# EAGLE design bare_attiny85 (EAGLE 8.1.0)
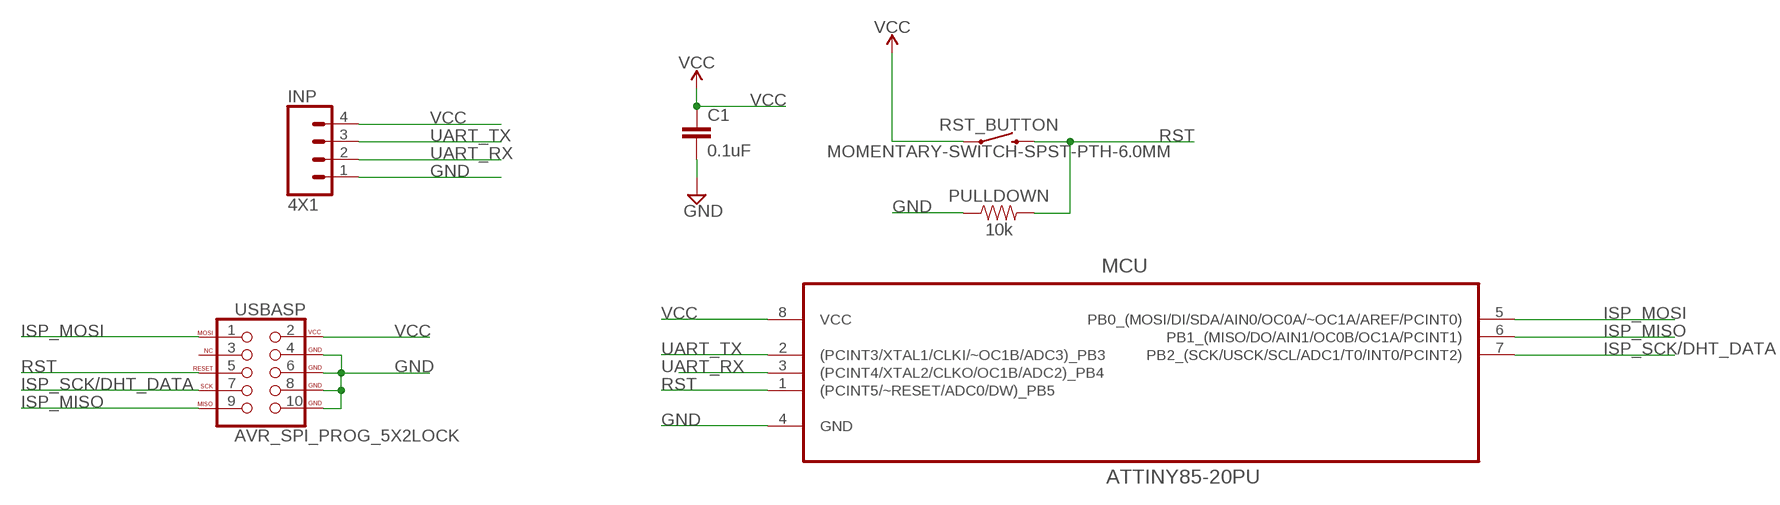
[diagram p0: schematic, sheet 1]

## Parts
C1  0.1uF  0.1UF-KIT-EZ-50V-20%  [CAP-PTH-SMALL-KIT]
INP  4X1  CONN_04  [1X04]
MCU  ATTINY85-20PU  [DIP254P762X533-8]
PULLDOWN  10k  10KOHM-HORIZ-1/4W-1%  [AXIAL-0.3]
RST_BUTTON  MOMENTARY-SWITCH-SPST-PTH-6.0MM  [TACTILE_SWITCH_PTH_6.0MM]
USBASP  AVR_SPI_PROG_5X2LOCK  [2X5-SHROUDED_LOCK]

## Nets
GND: C1.2 INP.1 MCU.4(GND) PULLDOWN.P$1 USBASP.4(GND) USBASP.6(GND) USBASP.8(GND) USBASP.10(GND)
ISP_MISO: MCU.6(PB1_(MISO/DO/AIN1/OC0B/OC1A/PCINT1)) USBASP.9(MISO)
ISP_MOSI: MCU.5(PB0_(MOSI/DI/SDA/AIN0/OC0A/~OC1A/AREF/PCINT0)) USBASP.1(MOSI)
ISP_SCK/DHT_DATA: MCU.7(PB2_(SCK/USCK/SCL/ADC1/T0/INT0/PCINT2)) USBASP.7(SCK)
RST: MCU.1((PCINT5/~RESET/ADC0/DW)_PB5) PULLDOWN.P$2 RST_BUTTON.3 USBASP.5(RESET)
UART_RX: INP.2 MCU.3((PCINT4/XTAL2/CLKO/OC1B/ADC2)_PB4)
UART_TX: INP.3 MCU.2((PCINT3/XTAL1/CLKI/~OC1B/ADC3)_PB3)
VCC: C1.1 INP.4 MCU.8(VCC) RST_BUTTON.1 USBASP.2(VCC)
Unconnected: USBASP.3(NC)

## Library data of the parts
C1 = SparkFun-Capacitors:0.1UF: 0.1µF ceramic capacitors A capacitor is a passive two-terminal electrical component used to store electrical energy temporarily in an electric field.; PROD_ID: CAP-08370
INP = SparkFun-Connectors:CONN_04: Multi connection point. Often used as Generic Header-pin footprint for 0.1 inch spaced/style header connections On any of the 0.1 inch spaced packages, you can populate with these: Break Away Headers - Straight <https://www.sparkfun.com/products/116> (PRT-00116) Break Away Male Headers - Right Angle <https://www.sparkfun.com/products/553> (PRT-00553) Female Headers <https://www.sparkfun.com/products/115> (PRT-00115) Break Away Headers - Machine Pin <https://www.sparkfun.com/products/117> (PRT-00117) Break Away Female Headers - Swiss Machine Pin <https://www.sparkfun.com/products/743> (PRT-00743) For SCREWTERMINALS and SPRING TERMINALS visit here: Screw Terimnals on SparkFun.com <https://www.sparkfun.com/search/results?term=Screw+Terminals> (5mm/3.5mm/2.54mm spacing) This device is also useful as a general connection point to wire up your design to another part of your project. Our various solder wires solder well into these plated through hole pads. Hook-Up Wire - Assortment (Stranded, 22 AWG) <https://www.sparkfun.com/products/11375> (PRT-11375) Hook-Up Wire - Assortment (Solid Core, 22 AWG) <https://www.sparkfun.com/products/11367> (PRT-11367) View the entire wire category on our website here <https://www.sparkfun.com/categories/141> Special notes: Molex polarized connector foot print use with SKU : PRT-08231 with associated crimp pins and housings. 1MM SMD Version SKU: PRT-10208; PROD_ID: CONN-09696
MCU = Atmel_By_element14_Batch_1-00:ATTINY85-20PU: 8-bit Microcontroller with In-System Programmable Flash; MPN: ATTINY85-20PU; OC_FARNELL: 1455162; OC_NEWARK: 58M3796; PACKAGE: PDIP-8; SUPPLIER: Atmel
PULLDOWN = SparkFun-Resistors:10KOHM: 10kΩ resistor A resistor is a passive two-terminal electrical component that implements electrical resistance as a circuit element. Resistors act to reduce current flow, and, at the same time, act to lower voltage levels within circuits. - Wikipedia; PROD_ID: RES-12183
RST_BUTTON = SparkFun-Switches:MOMENTARY-SWITCH-SPST: Momentary Switch (Pushbutton) - SPST Normally-open (NO) SPST momentary switches (buttons, pushbuttons). Variants PTH-12MM - 12mm square, through-hole Momentary Pushbutton Switch - 12mm Square <https://www.sparkfun.com/products/9190> (COM-09190) PTH-6.0MM, PTH-6.0MM-KIT - 6.0mm square, through-hole Mini Pushbutton Switch <https://www.sparkfun.com/products/97> (COM-00097) KIT package intended for soldering kit's - only one side of pads' copper is exposed. PTH-RIGHT-ANGLE-KIT - Right-angle, through-hole Right Angle Tactile Button <https://www.sparkfun.com/products/10791> - Used on SparkFun BigTime Watch Kit <https://www.sparkfun.com/products/11734> SMD-12MM - 12mm square, surface-mount Tactile Button - SMD (12mm) <https://www.sparkfun.com/products/12993> (COM-12993) Used on SparkFun PicoBoard <https://www.sparkfun.com/products/11888> SMD-4.5MM - 4.5mm Square Trackball Switch Used on SparkFun Blackberry Trackballer Breakout <https://www.sparkfun.com/products/13169> SMD-4.6MMX2.8MM - 4.60mm x 2.80mm, surface mount Used on SparkFun SAMD21 Mini Breakout <https://www.sparkfun.com/products/13664> SMD-5.2MM, SMD-5.2-REDUNDANT - 5.2mm square, surface-mount Mini Pushbutton Switch - SMD <https://www.sparkfun.com/products/8720> (COM-08720) Used on Arduino Pro Mini <https://www.sparkfun.com/products/11114> REDUNDANT package connects both switch circuits together SMD-6.0X3.5MM - 6.0 x 3.5mm, surface mount Momentary Reset Switch SMD <https://www.sparkfun.com/products/8229> (COM-08229) SMD-6.2MM-TALL - 6.2mm square, surface mount Tactile Button - SMD (6mm) <https://www.sparkfun.com/products/12992> Used on SparkFun Digital Sandbox <https://www.sparkfun.com/products/12651> SMD-RIGHT-ANGLE - Right-angle, surface mount Used on SparkFun Block for Intel® Edison - Arduino <https://www.sparkfun.com/products/13036>; PROD_ID: SWCH-08441; SF_SKU: COM-00097
USBASP = SparkFun-Connectors:AVR_SPI_PROG_5X2: AVR 10-pin ICSP Header This is the standard AVR In Circuit Serial Programming header. Minimal, but includes pin one indicator. Works with standard Olimex programmers. SparkFun Products: 2x5 AVR ICSP Male Header <https://www.sparkfun.com/products/778> - PTH 2x5 Pin Shrouded Header <https://www.sparkfun.com/products/8506> - PTH2; PROD_ID: CONN-08671; SF_ID: PRT-08506

## Board
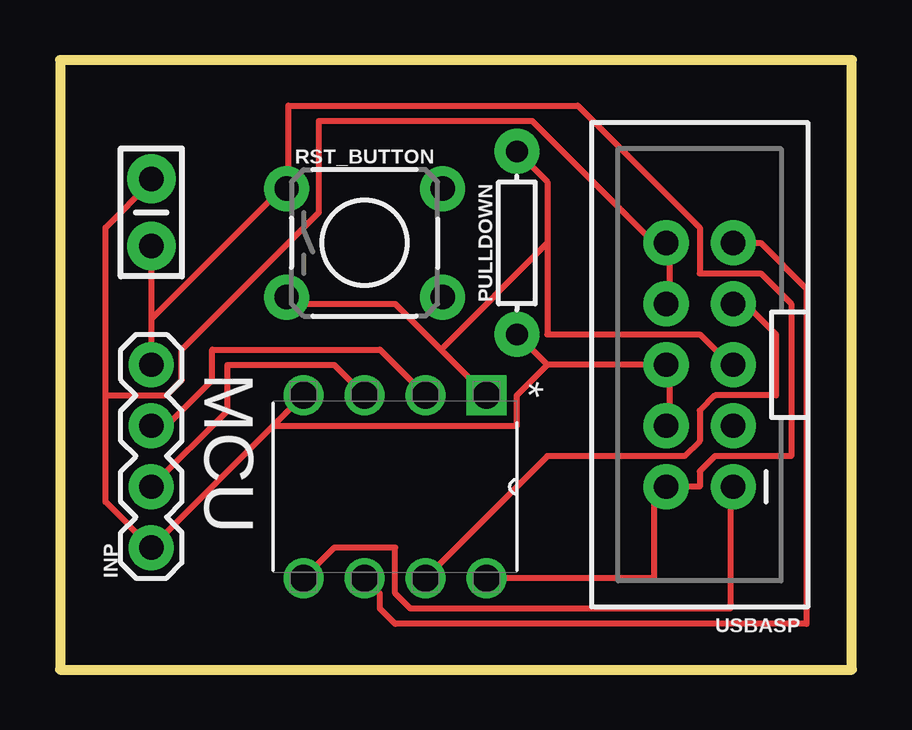
[diagram p1: board, top side]
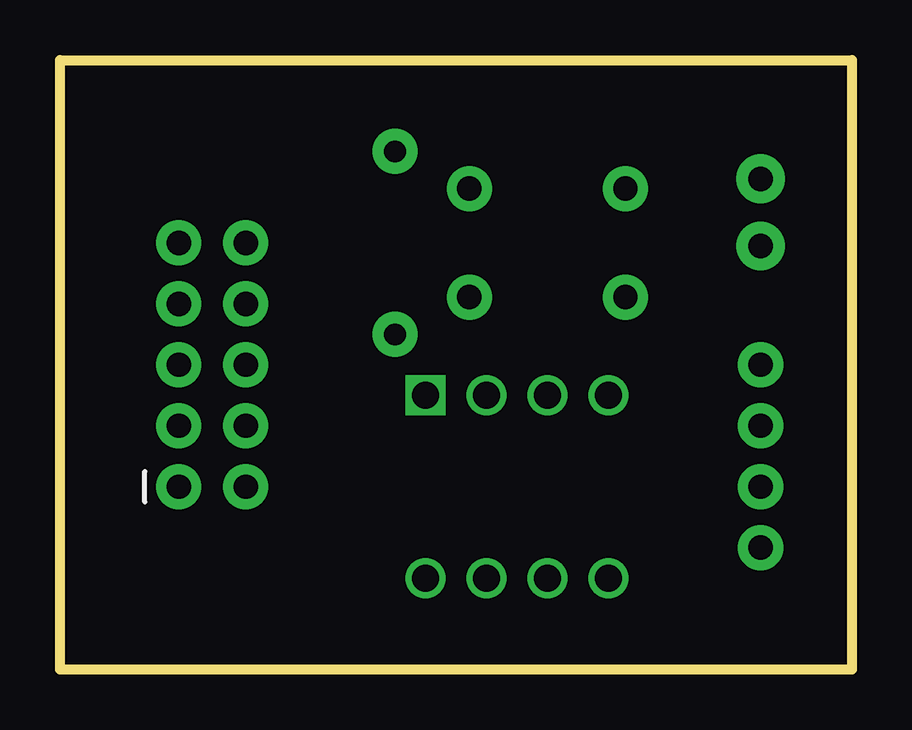
[diagram p2: board, bottom side, seen from below]

Size 33.02 x 25.4 mm. Coordinates in mm from the lower left corner, seen from the top.
Outline: 0,25.4 0,0 33.02,0 33.02,25.4 0,25.4
Copper layers (1*16): Top 0.035mm / dielectric 1.5mm / Bottom 0.035mm
Design rules "default": minimum track width 10mil, minimum drill 24mil, track to track 8mil, track to pad 8mil, pad to pad 8mil, via to via 8mil, smd to smd 8mil, copper to edge 40mil, drill to drill 8mil, minimum pad ring 10mil, minimum via ring 8mil, stop-mask expansion 4mil, vias tented up to drill 0mil, thermal gap 10mil

### Footprints (pad centres in the part's own frame; a part is rotated, then mirrored left to right if it is on the bottom)
CAP-PTH-SMALL-KIT = drill 1.016 pad 2.032: 1 -1.397,0; 2 1.397,0
1X04 = drill 1.016 pad 1.88: 1 0,0; 2 2.54,0; 3 5.08,0; 4 7.62,0
DIP254P762X533-8 = drill 1.118 square: 1 -7.62,7.62 | drill 1.118: 2 -7.62,5.08; 3 -7.62,2.54; 4 -7.62,0; 5 0,0; 6 0,2.54; 7 0,5.08; 8 0,7.62
AXIAL-0.3 = drill 0.9 pad 1.88: P$1 -3.81,0; P$2 3.81,0
TACTILE_SWITCH_PTH_6.0MM = drill 1.016 pad 1.88: 1 -3.251,2.261; 2 3.251,2.261; 3 -3.251,-2.261; 4 3.251,-2.261
2X5-SHROUDED_LOCK = drill 1.016 pad 1.88: 1 -1.397,5.08; 2 1.397,5.08; 3 -1.397,2.54; 4 1.397,2.54; 5 -1.397,0; 6 1.397,0; 7 -1.397,-2.54; 8 1.397,-2.54; 9 -1.397,-5.08; 10 1.397,-5.08

### Placement (x,y rotation side)
C1  3.81,19.05 90 top
INP  3.81,5.08 90 top
MCU  10.16,3.81 270 top
PULLDOWN  19.05,17.78 90 top
RST_BUTTON  12.7,17.78 0 top
USBASP  26.67,12.7 180 top

### Tracks (layer width: path | path; a pad name or v marks a point on that pad's centre or on a via)
GND
  Top 0.254: USBASP.4 25.4,10.16 25.4,12.7 USBASP.6 20.32,12.7 | 20.32,12.7 PULLDOWN.P$1 | USBASP.8 25.4,15.24 25.4,17.78 USBASP.10 24.77,17.78 19.68,22.86 10.79,22.86 10.79,19.05 5.08,13.34 5.08,12.06 4.45,11.43 1.91,11.43 | 8.89,10.16 INP.1 1.91,6.98 1.91,11.43 | 8.89,10.16 MCU.4 | 1.91,11.43 1.91,18.41 3.81,20.32 C1.2 | 20.32,12.7 19.05,11.43 19.05,10.16 8.89,10.16
ISP_MISO
  Top 0.254: MCU.6 13.33,3.17 13.33,2.54 13.97,1.91 31.11,1.91 31.11,15.88 29.21,17.78 USBASP.9
ISP_MOSI
  Top 0.254: MCU.5 11.43,5.08 13.97,5.08 13.97,3.17 14.61,2.54 27.94,2.54 27.94,7.62 USBASP.1
ISP_SCK/DHT_DATA
  Top 0.254: MCU.7 20.32,8.89 26.04,8.89 26.67,9.52 26.67,10.8 27.3,11.43 29.84,11.43 29.84,13.97 28.57,15.24 USBASP.7
RST
  Top 0.254: 15.88,13.34 13.97,15.24 9.53,15.24 RST_BUTTON.3 | 15.88,13.34 MCU.1 | 20.32,17.78 20.32,20.32 PULLDOWN.P$2 | 20.32,17.78 20.32,13.97 26.67,13.97 27.94,12.7 USBASP.5 | 20.32,17.78 15.88,13.34
UART_RX
  Top 0.254: MCU.3 11.43,12.7 6.98,12.7 6.98,10.8 INP.2
UART_TX
  Top 0.254: MCU.2 13.33,13.34 6.35,13.34 6.35,12.06 4.45,10.16 INP.3
VCC
  Top 0.254: MCU.8 24.77,3.81 24.77,7.62 USBASP.2 26.67,7.62 26.67,8.26 27.3,8.89 30.48,8.89 30.48,15.24 29.21,16.51 26.67,16.51 26.67,18.41 21.59,23.49 9.53,23.49 9.53,20.32 RST_BUTTON.1 8.89,19.69 3.81,14.6 | C1.1 3.81,14.6 | 3.81,14.6 INP.4